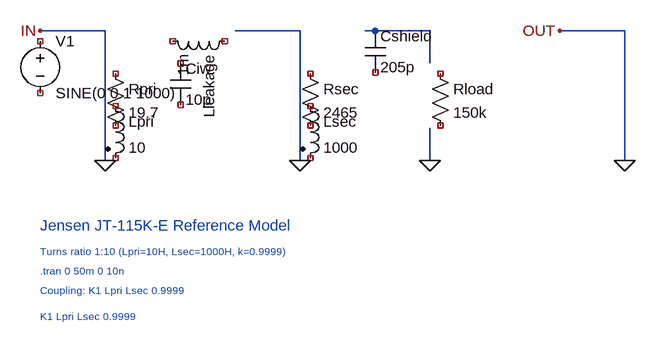
[diagram p0: schematic transformer_ref.asc]
transformer_ref.asc, the LTspice schematic file:
Version 4
SHEET 1 1200 680
* =============================================================================
* Jensen JT-115K-E — LTspice reference model
*
* Line input transformer, 1:10 turns ratio.
* Core: Mu-Metal 80% NiFe (EI lamination)
*
* Electrical parameters (from datasheet + jensen_jt115ke.json):
*   Rdc_primary   = 19.7 Ohm
*   Rdc_secondary = 2465 Ohm
*   Lp (primary)  = 10 H (estimated at low-level)
*   L_leakage     = 1 mH
*   C_interwinding = 10 pF
*   C_sec_shield  = 205 pF
*   Source Z       = 150 Ohm
*   Load Z         = 150 kOhm
*
* Frequency response targets:
*   -0.5 dB @ 20 Hz
*   -0.2 dB @ 20 kHz
*   -3 dB  @ 140 kHz
*   CMRR   ~ 110 dB @ 60 Hz
*
* THD targets:
*   0.065% @ 20 Hz, -20 dBu
*   1.0%   @ 20 Hz, -2.5 dBu
*   4.0%   @ 20 Hz, +1.2 dBu
*
* Reference: Jensen Transformers datasheet; Transfo_Model v3
* =============================================================================
WIRE 100 200 200 200
WIRE 200 200 200 250
WIRE 200 350 200 250
WIRE 200 350 200 400
WIRE 400 200 500 200
WIRE 500 200 500 250
WIRE 500 350 500 250
WIRE 500 350 500 400
WIRE 600 200 700 200
WIRE 700 200 700 250
WIRE 700 350 700 400
WIRE 900 200 1000 200
WIRE 1000 200 1000 400
FLAG 200 400 0
FLAG 500 400 0
FLAG 700 400 0
FLAG 1000 400 0
FLAG 100 200 IN
FLAG 900 200 OUT
SYMBOL voltage 100 200 R0
SYMATTR InstName V1
SYMATTR Value SINE(0 0.1 1000)
SYMATTR SpiceLine Rser=150
SYMBOL res 200 250 R0
SYMATTR InstName Rpri
SYMATTR Value 19.7
SYMBOL ind2 200 300 R0
SYMATTR InstName Lpri
SYMATTR Value 10
SYMATTR SpiceLine Rser=0
SYMBOL ind2 500 300 R0
SYMATTR InstName Lsec
SYMATTR Value 1000
SYMATTR SpiceLine Rser=0
SYMBOL res 500 250 R0
SYMATTR InstName Rsec
SYMATTR Value 2465
SYMBOL cap 600 200 R0
SYMATTR InstName Cshield
SYMATTR Value 205p
SYMBOL ind 400 200 R90
SYMATTR InstName Lleakage
SYMATTR Value 1m
SYMBOL cap 300 250 R0
SYMATTR InstName Ciw
SYMATTR Value 10p
SYMBOL res 700 250 R0
SYMATTR InstName Rload
SYMATTR Value 150k
TEXT 100 500 Left 2 ;Jensen JT-115K-E Reference Model
TEXT 100 540 Left 1 ;Turns ratio 1:10 (Lpri=10H, Lsec=1000H, k=0.9999)
TEXT 100 570 Left 1 ;.tran 0 50m 0 10n
TEXT 100 600 Left 1 ;Coupling: K1 Lpri Lsec 0.9999
* Mutual inductance coupling
TEXT 100 640 Left 1 ;K1 Lpri Lsec 0.9999

The netlist it stands for:
* transformer_ref.asc
V1 NC_01 NC_02 SINE(0 0.1 1000) Rser=150
Rpri NC_03 NC_04 19.7
Lpri NC_05 NC_06 10 Rser=0
Lsec NC_07 NC_08 1000 Rser=0
Rsec NC_09 NC_10 2465
Cshield N001 NC_11 205p
Lleakage NC_12 NC_13 1m
Ciw NC_14 NC_15 10p
Rload NC_16 NC_17 150k
* Jensen JT-115K-E Reference Model
* Turns ratio 1:10 (Lpri=10H, Lsec=1000H, k=0.9999)
* .tran 0 50m 0 10n
* Coupling: K1 Lpri Lsec 0.9999
* K1 Lpri Lsec 0.9999
.backanno
.end